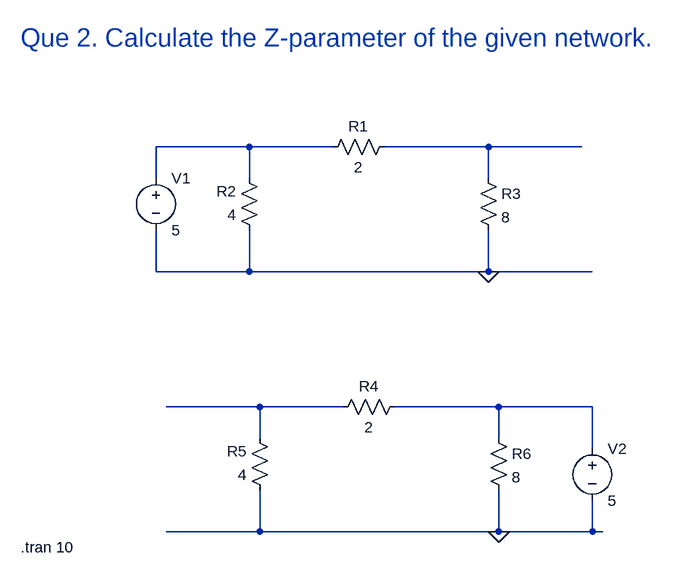
[diagram p0: schematic 2_Dheerendra_23EE019_Two_port.asc]
2_Dheerendra_23EE019_Two_port.asc, the LTspice schematic file:
Version 4
SHEET 1 924 760
WIRE 208 128 64 128
WIRE 336 128 208 128
WIRE 576 128 416 128
WIRE 720 128 576 128
WIRE 64 176 64 128
WIRE 208 176 208 128
WIRE 576 176 576 128
WIRE 64 320 64 256
WIRE 208 320 208 256
WIRE 208 320 64 320
WIRE 576 320 576 256
WIRE 576 320 208 320
WIRE 736 320 576 320
WIRE 224 528 80 528
WIRE 352 528 224 528
WIRE 592 528 432 528
WIRE 736 528 592 528
WIRE 224 576 224 528
WIRE 592 576 592 528
WIRE 736 592 736 528
WIRE 224 720 224 656
WIRE 224 720 80 720
WIRE 592 720 592 656
WIRE 592 720 224 720
WIRE 736 720 736 672
WIRE 736 720 592 720
WIRE 752 720 736 720
FLAG 576 320 0
FLAG 592 720 0
SYMBOL res 432 112 R90
WINDOW 0 0 56 VBottom 2
WINDOW 3 32 56 VTop 2
SYMATTR InstName R1
SYMATTR Value 2
SYMBOL res 224 272 R180
WINDOW 0 36 76 Left 2
WINDOW 3 36 40 Left 2
SYMATTR InstName R2
SYMATTR Value 4
SYMBOL res 560 160 R0
SYMATTR InstName R3
SYMATTR Value 8
SYMBOL res 448 512 R90
WINDOW 0 0 56 VBottom 2
WINDOW 3 32 56 VTop 2
SYMATTR InstName R4
SYMATTR Value 2
SYMBOL res 240 672 R180
WINDOW 0 36 76 Left 2
WINDOW 3 36 40 Left 2
SYMATTR InstName R5
SYMATTR Value 4
SYMBOL res 576 560 R0
SYMATTR InstName R6
SYMATTR Value 8
SYMBOL voltage 64 160 R0
WINDOW 123 0 0 Left 0
WINDOW 39 0 0 Left 0
SYMATTR InstName V1
SYMATTR Value 5
SYMBOL voltage 736 576 R0
WINDOW 123 0 0 Left 0
WINDOW 39 0 0 Left 0
SYMATTR InstName V2
SYMATTR Value 5
TEXT -144 -40 Left 4 ;Que 2. Calculate the Z-parameter of the given network.
TEXT -144 744 Left 2 !.tran 10

The netlist it stands for:
* 2_Dheerendra_23EE019_Two_port.asc
R1 N002 N001 2
R2 0 N001 4
R3 N002 0 8
R4 N004 N003 2
R5 0 N003 4
R6 N004 0 8
V1 N001 0 5
V2 N004 0 5
* Que 2. Calculate the Z-parameter of the given network.
.tran 10
.backanno
.end